# Altium schematic sheet 充电桩应用监管系统.SchDoc
size A4
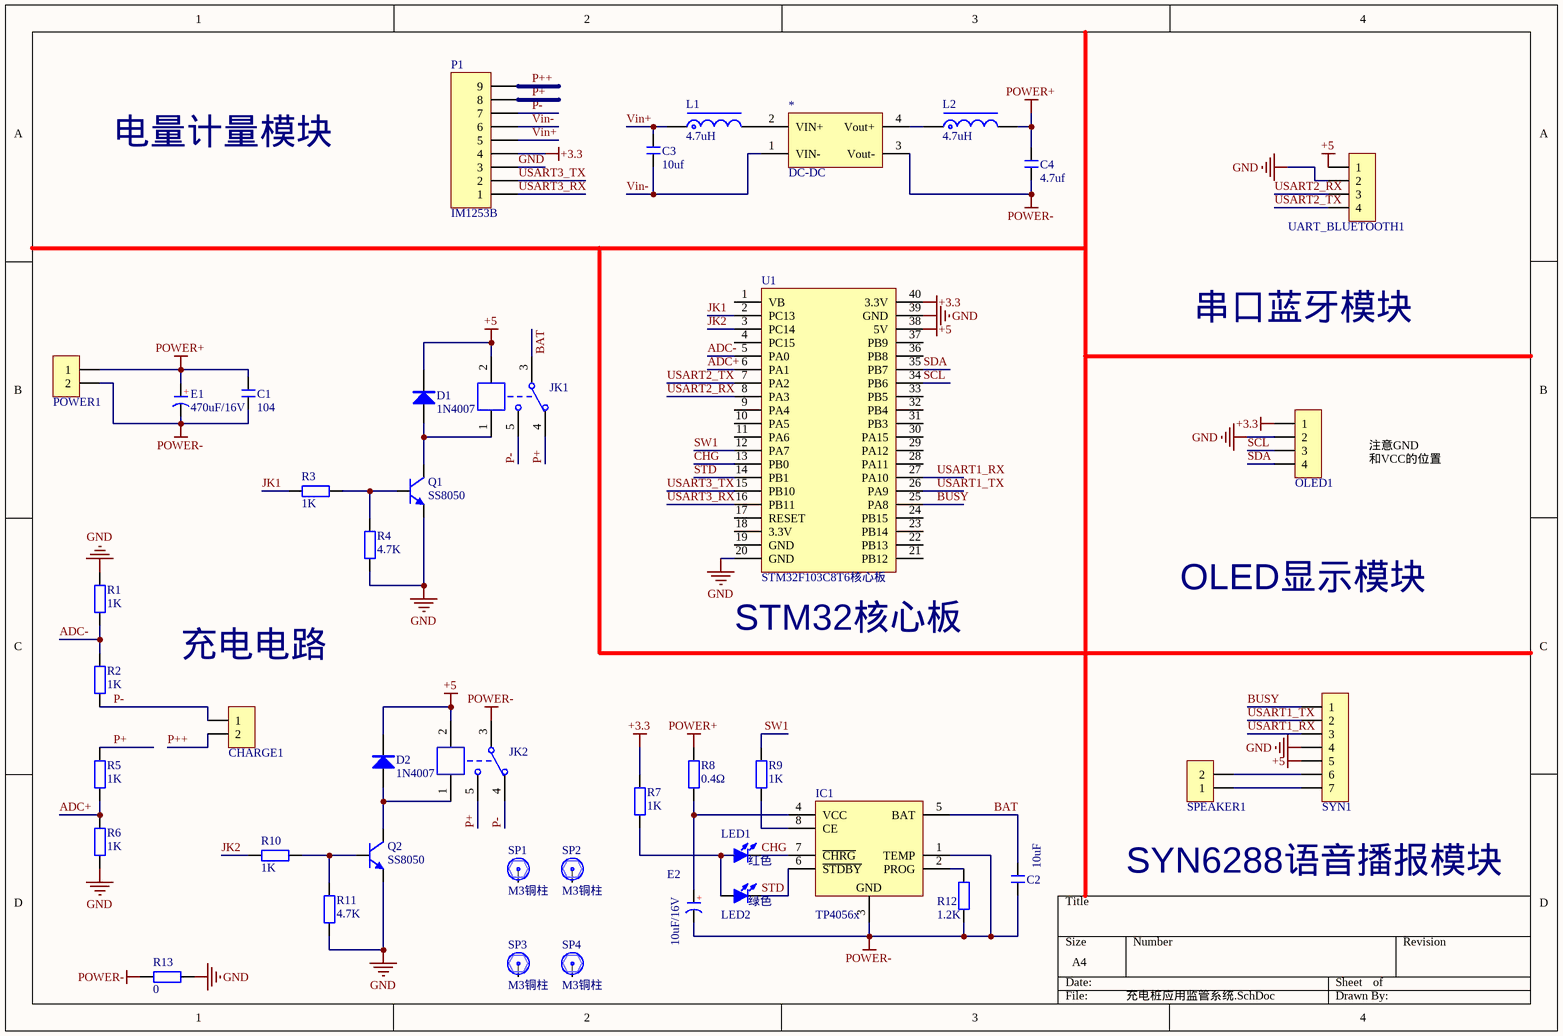
[diagram p0: 充电桩应用监管系统.SchDoc]

## Parts
*  DC-DC
C1  104  [R 0805_M]
C2  10uF  [C 1206_M]
C3  10uf  [R 0805_M]
C4  4.7uf  [R 0805_M]
CHARGE1  HDR-1X2  [KF301-5.0-2P]  (value not drawn)
D1  1N4007  [DO-41]
D2  1N4007  [DO-41]
E1  470uF/16V  [CAP 2.0*5*11 - BK]
E2  10uF/16V  [CAP 2.0*5*11 - BK]
IC1  TP4056x  [ESOP8_M]
JK1  (no value)  [SRD-C_B]
JK2  (no value)  [SRD-C_B]
L1  4.7uH  [NR2520]
L2  4.7uH  [NR2520]
LED1  红色  [LED 0805R]
LED2  绿色  [LED 0805G]
OLED1  HDR-1X4  [HDR2.54-M-LI-4P]  (value not drawn)
P1  IM1253B  [HDR1X9]
POWER1  HDR-1X2  [KF301-5.0-2P]  (value not drawn)
Q1  SS8050  [TO92A]
Q2  SS8050  [TO92A]
R1  1K  [R 0805_M]
R2  1K  [R 0805_M]
R3  1K  [R 0805_M]
R4  4.7K  [R 0805_M]
R5  1K  [R 0805_M]
R6  1K  [R 0805_M]
R7  1K  [R 0805_M]
R8  0.4Ω  [R 0805_M]
R9  1K  [R 0805_M]
R10  1K  [R 0805_M]
R11  4.7K  [R 0805_M]
R12  1.2K  [R 0805_M]
R13  0  [R 0805_M]
SP1  M3铜柱  [M3x4_L]
SP2  M3铜柱  [M3x4_L]
SP3  M3铜柱  [M3x4_L]
SP4  M3铜柱  [M3x4_L]
SPEAKER1  HDR-1X2  [KF301-5.0-2P]  (value not drawn)
SYN1  HDR-1X7  [PH2.0-LI-7P]  (value not drawn)
U1  STM32F103C8T6核心板  [DIP40-600_MH]
UART_BLUETOOTH1  HDR-1X4  [HDR2.54-M-LI-4P]  (value not drawn)

## Nets
+3.3: OLED1.1 P1.4 R7.2 U1.40(3.3V)
+5: D1.2(K) D2.2(K) JK1.2 JK2.2 SYN1.5 U1.38(5V) UART_BLUETOOTH1.1
GND: OLED1.2 P1.3 Q1.1(E) Q2.1(E) R1.2 R4.1 R6.1 R11.1 R13.1 SYN1.4 U1.20(GND) U1.39(GND) UART_BLUETOOTH1.2
POWER+: C1.1 C4.1 E1.1(A) L2.2 POWER1.1 R8.2
POWER-: *.3(Vout-) C1.2 C2.1 C4.2 E1.2(K) E2.2(K) IC1.1(TEMP) IC1.3(GND) JK2.3 POWER1.2 R12.1 R13.2
ADC+: R5.1 R6.2 U1.6(PA1)
ADC-: R1.1 R2.2 U1.5(PA0)
BAT: C2.2 IC1.5(BAT) JK1.3
BUSY: SYN1.1 U1.25(PA8)
CHG: IC1.7(~{CHRG}) LED1.2(K) U1.13(PB0)
JK1: R3.1 U1.2(PC13)
JK2: R10.1 U1.3(PC14)
P+: JK1.4 JK2.5 P1.8 R5.2
P++: CHARGE1.2 P1.9
P-: CHARGE1.1 JK1.5 JK2.4 P1.7 R2.1
SCL: OLED1.3 U1.34(PB6)
SDA: OLED1.4 U1.35(PB7)
STD: IC1.6(~{STDBY}) LED2.2(K) U1.14(PB1)
SW1: R9.1 U1.12(PA7)
USART1_RX: SYN1.3 U1.27(PA10)
USART1_TX: SYN1.2 U1.26(PA9)
USART2_RX: U1.8(PA3) UART_BLUETOOTH1.3
USART2_TX: U1.7(PA2) UART_BLUETOOTH1.4
USART3_RX: P1.1 U1.16(PB11)
USART3_TX: P1.2 U1.15(PB10)
Vin+: C3.1 L1.1 P1.5
Vin-: *.1(VIN-) C3.2 P1.6
Net*_2: *.2(VIN+) L1.2
Net*_4: *.4(Vout+) L2.1
NetD1_1: D1.1(A) JK1.1 Q1.3(C)
NetD2_1: D2.1(A) JK2.1 Q2.3(C)
NetE2_1: E2.1(A) IC1.4(VCC) R8.1
NetIC1_2: IC1.2(PROG) R12.2
NetIC1_8: IC1.8(CE) R9.2
NetLED1_1: LED1.1(A) LED2.1(A) R7.1
NetQ1_2: Q1.2(B) R3.2 R4.2
NetQ2_2: Q2.2(B) R10.2 R11.2
NetSPEAKER1_1: SPEAKER1.1 SYN1.7
NetSPEAKER1_2: SPEAKER1.2 SYN1.6

Not connected (* = marked no-connect by the designer): SP1 1; SP2 1; SP3 1; SP4 1; U1 1(VB) 4(PC15) 9(PA4) 10(PA5) 11(PA6) 17(RESET) 18(3.3V) 19(GND) 21(PB12) 22(PB13) 23(PB14) 24(PB15) 28(PA11) 29(PA12) 30(PA15) 31(PB3) 32(PB4) 33(PB5) 36(PB8) 37(PB9)

## Notes on the sheet
- 电量计量模块
- 串口蓝牙模块
- 注意GND
  和VCC的位置
- (near U1) STM32核心板
- OLED显示模块
- 充电电路
- SYN6288语音播报模块
- (in symbol C-CAP) +

## Library data of the parts
* = Component_1
C1 C3 C4 = C-CC: 直插瓷片电容; 版权归属: 源创客; BOM名称: 直插瓷片电容; 学习资源: www.ooocke.com
C2 = C: 无极性贴片电容; 版权归属: 源创客; 材质: X7R; BOM名称: 无极性贴片电容; 学习资源: www.ooocke.com
CHARGE1 POWER1 SPEAKER1 = Header 2: 2P接插件; 版权归属: 源创客; BOM名称: 2P接插件; 学习资源: www.ooocke.com
D1 D2 = 1N4007: 整流二极管; 版权归属: 源创客; BOM名称: 整流二极管; 学习资源: www.ooocke.com
E1 E2 = C-CAP: 直插电解电容; pin to pad: 1>A 2>K; 版权归属: 源创客; BOM名称: 直插电解电容; 学习资源: www.ooocke.com
IC1 = TP4056: 锂电池充电管理; 版权归属: 源创客; BOM名称: 锂电池充电管理; 学习资源: www.ooocke.com
JK1 JK2 = SRD-05VDC-SL-C: 5V一组转换; BOM名称: 5V继电器; 版权归属: 源创客; 学习资源: www.ooocke.com
L1 L2 = L-NR: NR磁胶电感; 版权归属: 源创客; BOM名称: NR磁胶电感; 学习资源: www.ooocke.com
LED1 LED2 = LED-3MM: 插件LED; 版权归属: 源创客; BOM名称: 插件LED; 学习资源: www.ooocke.com
OLED1 UART_BLUETOOTH1 = Header 4: 4P接插件; 版权归属: 源创客; BOM名称: 4P接插件; 学习资源: www.ooocke.com
P1 = Header 9: Header, 9-Pin; LatestRevisionDate: 17-Jul-2002; LatestRevisionNote: Re-released for DXP Platform.; Publisher: Altium Limited
Q1 Q2 = 8050-DIP: 高频放大-NPN型; 版权归属: 源创客; 属性: 40V 1.5A 1W 100MHZ; BOM名称: 高频放大-NPN型; 学习资源: www.ooocke.com
R1-R13 = R-CRR: 直插色环电阻; BOM名称: 色环电阻; 版权归属: 源创客; 学习资源: www.ooocke.com
SP1-SP4 = 铜柱小焊盘: 铜柱; 版权归属: 源创客; BOM名称: 铜柱; 学习资源: www.ooocke.com
SYN1 = Header 7: 7P接插件; 版权归属: 源创客; BOM名称: 7P接插件; 学习资源: www.ooocke.com